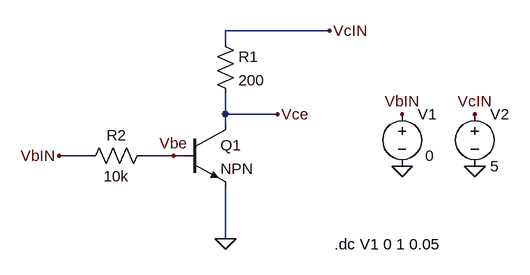
[diagram p0: schematic Experiment1_NPN_5V.asc]
Experiment1_NPN_5V.asc, the LTspice schematic file:
Version 4.1
SHEET 1 880 680
WIRE 368 -48 208 -48
WIRE 208 -32 208 -48
WIRE 208 80 208 48
WIRE 288 80 208 80
WIRE 208 96 208 80
WIRE 0 144 -48 144
WIRE 128 144 80 144
WIRE 144 144 128 144
WIRE 208 272 208 192
FLAG 208 272 0
FLAG 368 -48 VcIN
FLAG -48 144 VbIN
FLAG 128 144 Vbe
FLAG 288 80 Vce
FLAG 480 80 VbIN
FLAG 592 80 VcIN
FLAG 480 160 0
FLAG 592 160 0
SYMBOL npn 144 96 R0
SYMATTR InstName Q1
SYMBOL res 192 -48 R0
SYMATTR InstName R1
SYMATTR Value 200
SYMBOL res 96 128 R90
WINDOW 0 0 56 VBottom 2
WINDOW 3 32 56 VTop 2
SYMATTR InstName R2
SYMATTR Value 10k
SYMBOL voltage 480 64 R0
WINDOW 3 36 80 Left 2
WINDOW 123 0 0 Left 0
WINDOW 39 0 0 Left 0
SYMATTR Value 0
SYMATTR InstName V1
SYMBOL voltage 592 64 R0
WINDOW 123 0 0 Left 0
WINDOW 39 0 0 Left 0
SYMATTR InstName V2
SYMATTR Value 5
TEXT 376 280 Left 2 !.dc V1 0 1 0.05

The netlist it stands for:
* Experiment1_NPN_5V.asc
Q1 Vce Vbe 0 0 NPN
R1 VcIN Vce 200
R2 Vbe VbIN 10k
V1 VbIN 0 0
V2 VcIN 0 5
.model NPN NPN
.model PNP PNP
.lib standard.bjt
.dc V1 0 1 0.05
.backanno
.end

* Results of the author's LTspice run, read from the files saved beside the schematic
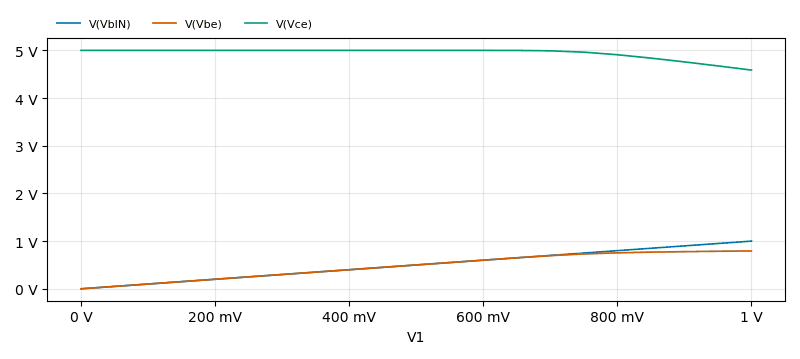
[diagram p1: DC transfer characteristic of Experiment1_NPN_5V.asc, plotted from the saved traces]
* DC transfer characteristic, 1 run:
*   V(VbIN): 0 V at V1=0 V, 1 V at V1=1 V, min 0 V, max 1 V
*   V(Vbe): 50 nV at V1=0 V, 793 mV at V1=1 V, min 50 nV, max 793 mV
*   V(Vce): 5 V at V1=0 V, 4.586 V at V1=1 V, min 4.586 V, max 5 V